# Altium schematic sheet 光耦输入&AD输入.SchDoc
size A4
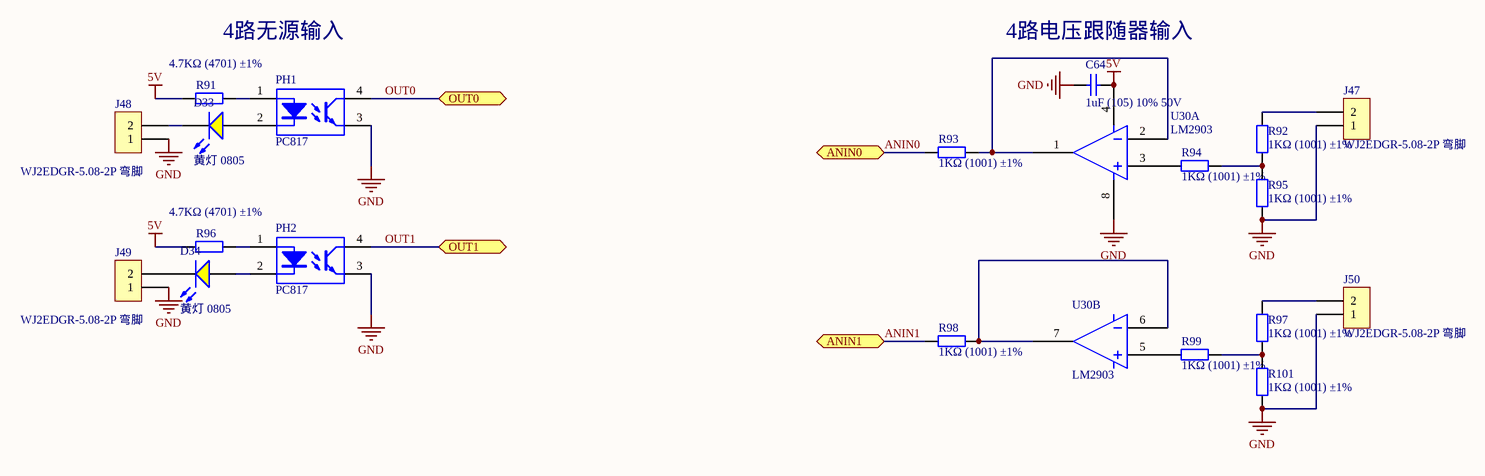
[diagram p0: 光耦输入&AD输入.SchDoc]

## Parts
C64  1uF (105) 10% 50V  [0805_C]
D33  黄灯 0805  [0805_LED_S1]
D34  黄灯 0805  [0805_LED_S1]
J47  WJ2EDGR-5.08-2P 弯脚  [WJ2EDGR-5.08-2]
J48  WJ2EDGR-5.08-2P 弯脚  [WJ2EDGR-5.08-2]
J49  WJ2EDGR-5.08-2P 弯脚  [WJ2EDGR-5.08-2]
J50  WJ2EDGR-5.08-2P 弯脚  [WJ2EDGR-5.08-2]
PH1  PC817  [SOP-4_P2.54]
PH2  PC817  [SOP-4_P2.54]
R91  4.7KΩ (4701) ±1%  [0805_R]
R92  1KΩ (1001) ±1%  [0805_R]
R93  1KΩ (1001) ±1%  [0805_R]
R94  1KΩ (1001) ±1%  [0805_R]
R95  1KΩ (1001) ±1%  [0805_R]
R96  4.7KΩ (4701) ±1%  [0805_R]
R97  1KΩ (1001) ±1%  [0805_R]
R98  1KΩ (1001) ±1%  [0805_R]
R99  1KΩ (1001) ±1%  [0805_R]
R101  1KΩ (1001) ±1%  [0805_R]
U30  LM2903  [SOP-8]  (parts A,B of 2)

## Ports
ANIN0, ANIN1, OUT0, OUT1

## Nets
5V: C64.2 R91.1 R96.1 U30.4
GND: C64.1 J47.1 J48.1 J49.1 J50.1 PH1.3(E) PH2.3(E) R95.1 R101.1 U30.8
ANIN0: R93.2 ; port ANIN0
ANIN1: R98.2 ; port ANIN1
OUT0: PH1.4(C) ; port OUT0
OUT1: PH2.4(C) ; port OUT1
NetD33_A: D33.A PH1.2(K)
NetD33_K: D33.K J48.2
NetD34_A: D34.A PH2.2(K)
NetD34_K: D34.K J49.2
NetJ47_2: J47.2 R92.2
NetJ50_2: J50.2 R97.2
NetPH1_1: PH1.1(A) R91.2
NetPH2_1: PH2.1(A) R96.2
NetR92_1: R92.1 R94.1 R95.2
NetR93_1: R93.1 U30.1 U30.2
NetR94_2: R94.2 U30.3
NetR97_1: R97.1 R99.1 R101.2
NetR98_1: R98.1 U30.6 U30.7
NetR99_2: R99.2 U30.5

## Notes on the sheet
- 4路无源输入
- (near C64) 4路电压跟随器输入

## Library data of the parts
C64 = 0805 1uF (105) 10% 50V: 贴片电容; ComponentLink1Description: 供应商链接; ComponentLink1URL: http://www.szlcsc.com/product/details_29074.html; Package: 0805; Supplier: LC; SuppliersPartNumber: C28323
D33 D34 = 0805 黄灯: 发光二极管; ComponentLink1Description: 供应商链接; ComponentLink1URL: http://www.szlcsc.com/product/details_2669.html; Package: 0805; Supplier: LC; SuppliersPartNumber: C2296
J47-J50 = WJ2EDGR-5.08-2P 弯脚: 2EDG连接器; ComponentLink1URL: https://detail.tmall.com/item.htm?spm=a1z10.5-b.w4011-14865958799.85.B0p41N&id=45355509244&rn=e90e7252b5175cd006380c5c01151190&abbucket=9; price: 0.28; Supplier: Farpu; SuppliersPartNumber: *; Manufacturer: *; ComponentLink1Description: 供应商链接
PH1 PH2 = PC817: Optoisolator
R91 R96 = 0805 4.7KΩ (4701) 1%: 贴片电阻; ComponentLink1Description: 供应商链接; ComponentLink1URL: http://www.szlcsc.com/product/details_18361.html; Package: 0805; Supplier: LC; SuppliersPartNumber: C17673
R92-R95 R97-R99 R101 = 0805 1KΩ (1001) 1%: 贴片电阻; ComponentLink1Description: 供应商链接; ComponentLink1URL: http://www.szlcsc.com/product/details_18201.html; Package: 0805; Supplier: LC; SuppliersPartNumber: C17513
U30 = LM193